# Altium schematic sheet 12_GPIO_I2S0_PDM_SPDIF.SchDoc: P30L
size A2; Organization: 六零加智能科技; Address4: www.nidone.com.cn; DocumentNumber: Kang jin; Revision: 1.0; SheetNumber: 12; SheetTotal: 23
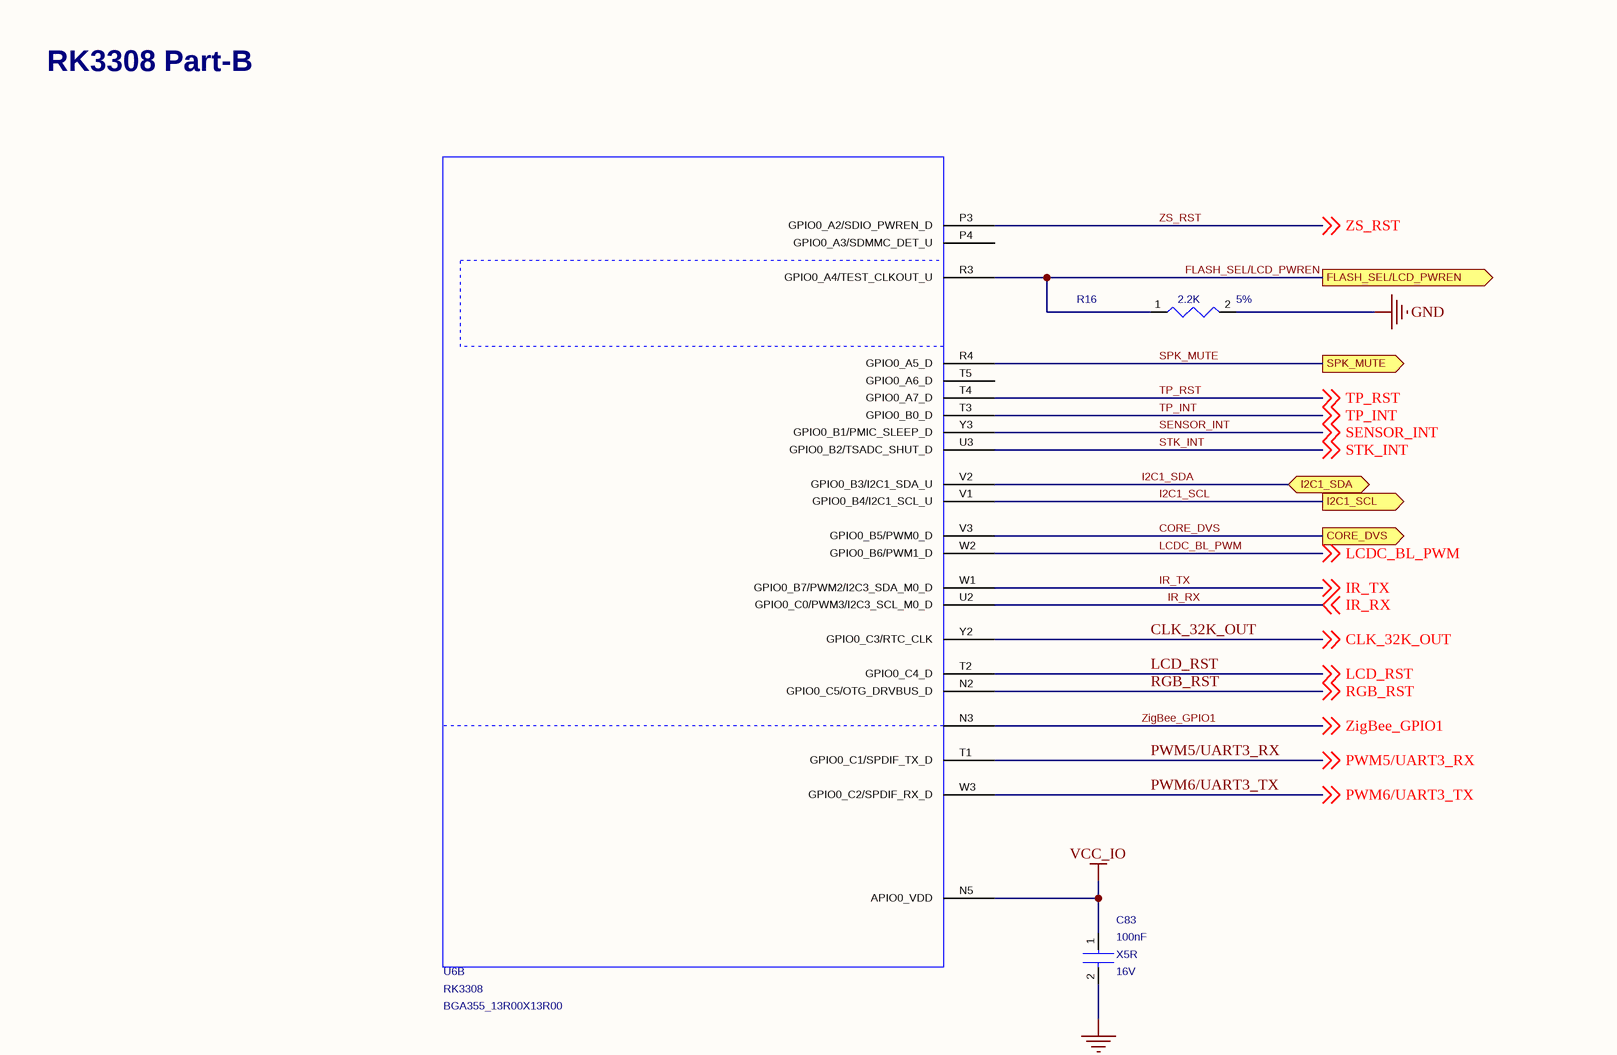
[diagram p0: 12_GPIO_I2S0_PDM_SPDIF.SchDoc, top left]
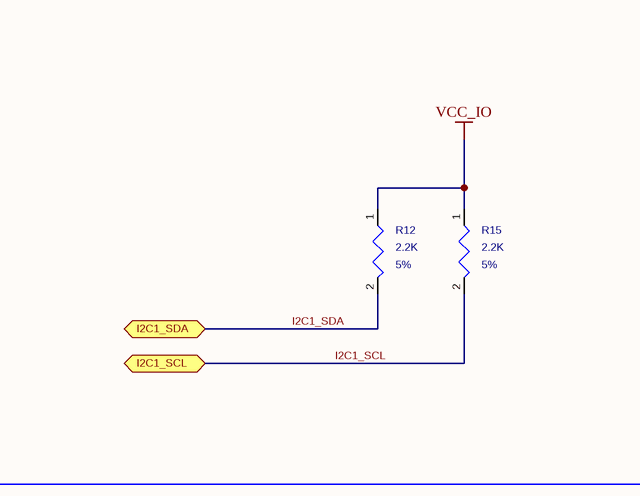
[diagram p1: 12_GPIO_I2S0_PDM_SPDIF.SchDoc, top right]
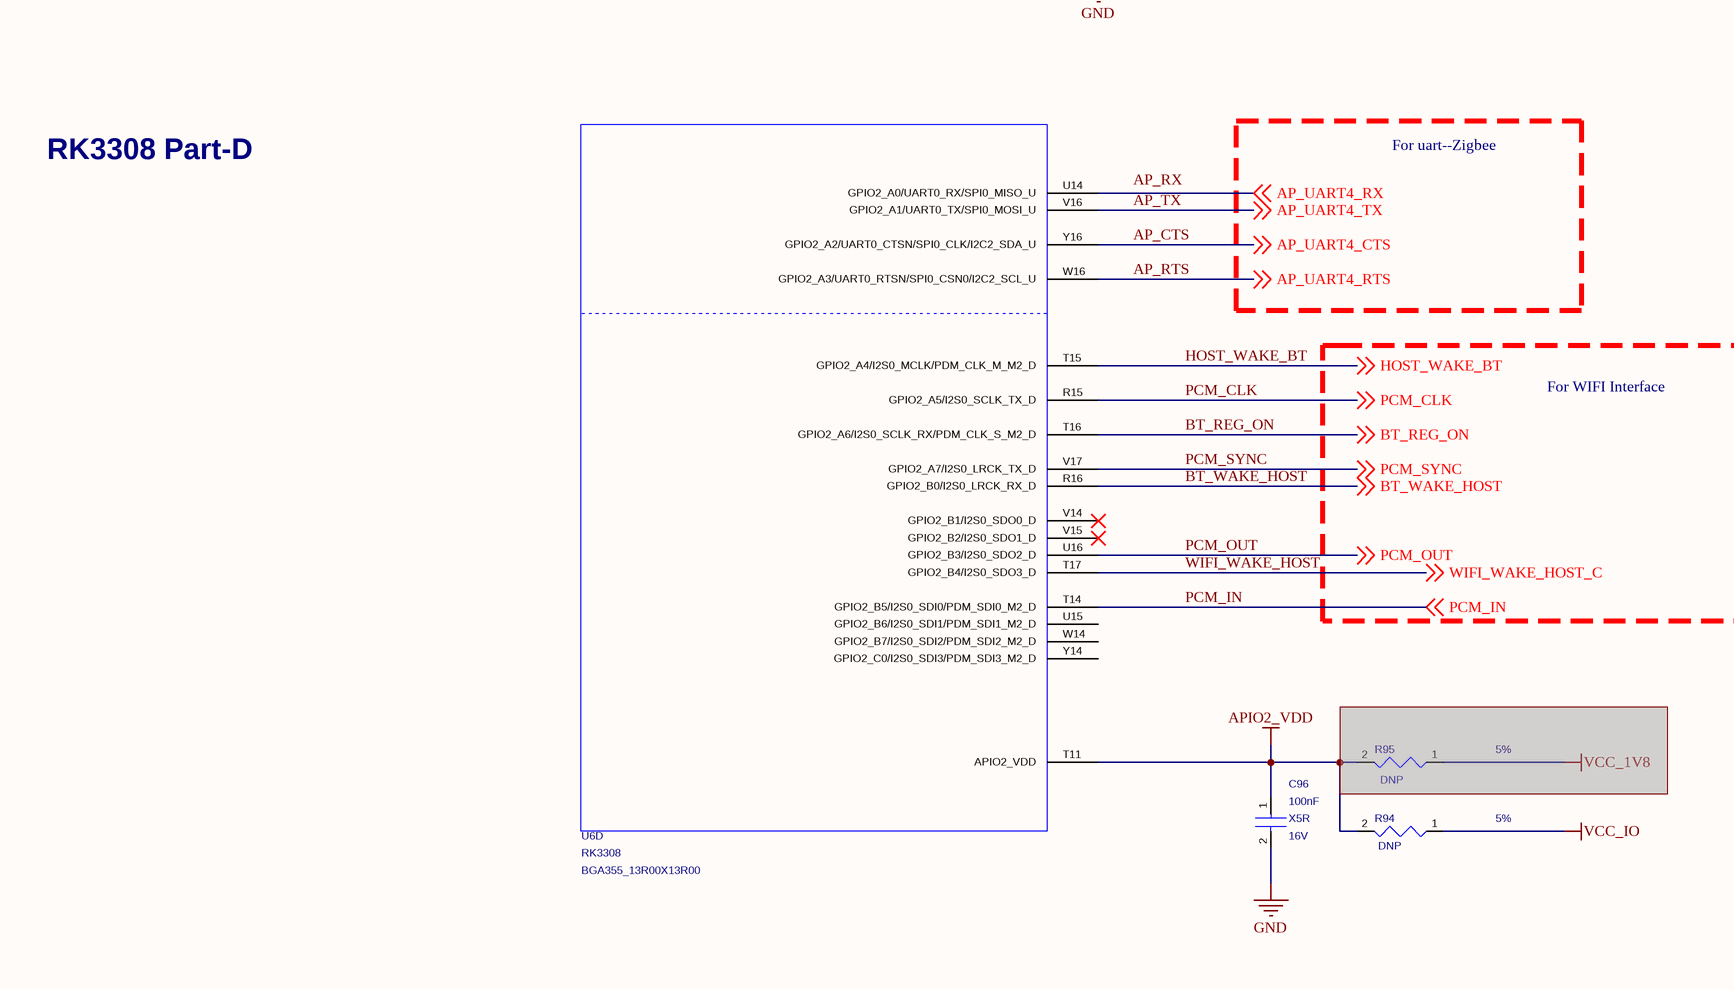
[diagram p2: 12_GPIO_I2S0_PDM_SPDIF.SchDoc, bottom left]

## Parts
C83  value 100nF  Voltage: 16V  Dielectric: X5R  [C0402]  (hidden comment: CAP_NP_2)
C96  value 100nF  Dielectric: X5R  Voltage: 16V  [C0402]  (hidden comment: CAP_NP_2)
R12  value 2.2K  Tolerance: 5%  [R0402]  (hidden comment: RESISTOR)
R15  value 2.2K  Tolerance: 5%  [R0402]  (hidden comment: RESISTOR)
R16  value 2.2K  Tolerance: 5%  [R0402]  (hidden comment: RESISTOR)
R94  Tolerance: 5%  Option: DNP  [R0402]  (hidden comment: RESISTOR)
R95  Tolerance: 5%  Option: DNP  [R0402]  (hidden comment: RESISTOR)  (masked out: inside a compile mask, not in the netlist)
U6  RK3308  [BGA355_13R00X13R00]  (parts B,D of 14)

## Ports
CORE_DVS (out), FLASH_SEL/LCD_PWREN (out), I2C1_SCL (bidir), I2C1_SCL (out), I2C1_SDA (bidir), SPK_MUTE (out)

## Nets
APIO2_VDD: C96.1 R94.2 U6.T11(APIO2_VDD)
GND: C83.2 C96.2 R16.2
VCC_IO: C83.1 R12.1 R15.1 R94.1 U6.N5(APIO0_VDD)
AP_CTS: U6.Y16(GPIO2_A2/UART0_CTSN/SPI0_CLK/I2C2_SDA_U) ; off-sheet AP_UART4_CTS  [also labelled AP_UART4_CTS]
AP_RTS: U6.W16(GPIO2_A3/UART0_RTSN/SPI0_CSN0/I2C2_SCL_U) ; off-sheet AP_UART4_RTS  [also labelled AP_UART4_RTS]
AP_TX: U6.V16(GPIO2_A1/UART0_TX/SPI0_MOSI_U) ; off-sheet AP_UART4_TX  [also labelled AP_UART4_TX]
AP_UART4_RX: U6.U14(GPIO2_A0/UART0_RX/SPI0_MISO_U) ; off-sheet AP_UART4_RX
BT_REG_ON: U6.T16(GPIO2_A6/I2S0_SCLK_RX/PDM_CLK_S_M2_D) ; off-sheet BT_REG_ON
BT_WAKE_HOST: U6.R16(GPIO2_B0/I2S0_LRCK_RX_D) ; off-sheet BT_WAKE_HOST
CLK_32K_OUT: U6.Y2(GPIO0_C3/RTC_CLK) ; off-sheet CLK_32K_OUT
CORE_DVS: U6.V3(GPIO0_B5/PWM0_D) ; port CORE_DVS
FLASH_SEL/LCD_PWREN: R16.1 U6.R3(GPIO0_A4/TEST_CLKOUT_U) ; port FLASH_SEL/LCD_PWREN
HOST_WAKE_BT: U6.T15(GPIO2_A4/I2S0_MCLK/PDM_CLK_M_M2_D) ; off-sheet HOST_WAKE_BT
I2C1_SCL: R15.2 U6.V1(GPIO0_B4/I2C1_SCL_U) ; port I2C1_SCL
I2C1_SDA: R12.2 U6.V2(GPIO0_B3/I2C1_SDA_U) ; port I2C1_SDA
IR_RX: U6.U2(GPIO0_C0/PWM3/I2C3_SCL_M0_D) ; off-sheet IR_RX
IR_TX: U6.W1(GPIO0_B7/PWM2/I2C3_SDA_M0_D) ; off-sheet IR_TX
LCD_RST: U6.T2(GPIO0_C4_D) ; off-sheet LCD_RST
LCDC_BL_PWM: U6.W2(GPIO0_B6/PWM1_D) ; off-sheet LCDC_BL_PWM
PCM_CLK: U6.R15(GPIO2_A5/I2S0_SCLK_TX_D) ; off-sheet PCM_CLK
PCM_IN: U6.T14(GPIO2_B5/I2S0_SDI0/PDM_SDI0_M2_D) ; off-sheet PCM_IN
PCM_OUT: U6.U16(GPIO2_B3/I2S0_SDO2_D) ; off-sheet PCM_OUT
PCM_SYNC: U6.V17(GPIO2_A7/I2S0_LRCK_TX_D) ; off-sheet PCM_SYNC
PWM5/UART3_RX: U6.T1(GPIO0_C1/SPDIF_TX_D) ; off-sheet PWM5/UART3_RX
PWM6/UART3_TX: U6.W3(GPIO0_C2/SPDIF_RX_D) ; off-sheet PWM6/UART3_TX
RGB_RST: U6.N2(GPIO0_C5/OTG_DRVBUS_D) ; off-sheet RGB_RST
SENSOR_INT: U6.Y3(GPIO0_B1/PMIC_SLEEP_D) ; off-sheet SENSOR_INT
SPK_MUTE: U6.R4(GPIO0_A5_D) ; port SPK_MUTE
STK_INT: U6.U3(GPIO0_B2/TSADC_SHUT_D) ; off-sheet STK_INT
TP_INT: U6.T3(GPIO0_B0_D) ; off-sheet TP_INT
TP_RST: U6.T4(GPIO0_A7_D) ; off-sheet TP_RST
WIFI_WAKE_HOST: U6.T17(GPIO2_B4/I2S0_SDO3_D) ; off-sheet WIFI_WAKE_HOST_C  [also labelled WIFI_WAKE_HOST_C]
ZigBee_GPIO1: U6.N3 ; off-sheet ZigBee_GPIO1
ZS_RST: U6.P3(GPIO0_A2/SDIO_PWREN_D) ; off-sheet ZS_RST

Not connected (* = marked no-connect by the designer): U6 P4(GPIO0_A3/SDMMC_DET_U) T5(GPIO0_A6_D) U15(GPIO2_B6/I2S0_SDI1/PDM_SDI1_M2_D) V14(GPIO2_B1/I2S0_SDO0_D)* V15(GPIO2_B2/I2S0_SDO1_D)* W14(GPIO2_B7/I2S0_SDI2/PDM_SDI2_M2_D) Y14(GPIO2_C0/I2S0_SDI3/PDM_SDI3_M2_D)

## Notes on the sheet
- RK3308 Part-B
- RK3308 Part-D
- For uart--Zigbee
- For WIFI Interface
- Labels drawn without touching a wire or pin: AP_RX
- Title
- Size:
- Date:
- File:
- A2
- Engineer:
- Time:
- Revision:
- Sheet
- of

## Library data of the parts
C83 = CAP_NP_2: cap,100.00nF,+/-10%,16V,X5R,C0402; Manufacturer_PN: C1005X5R1C104K050BA; Manufacturer: TDK; Created_by: JJJ; Tolerance: 10%; Priority: A; Source_Path: Z:\RK_STANDARD_LIBRARY\CADENCE_CIS\RK_DISCRETE.OLB; Number: 1; Part_Type: C0402; RK_PN: C1005X5R1C104K050BA; PCB DECAL: C0402
C96 = CAP_NP_2: cap,100.00nF,+/-10%,16V,X5R,C0402; Manufacturer: TDK; RK_PN: C1005X5R1C104K050BA; Priority: A; Tolerance: 10%; Created_by: JJJ; Source_Path: Z:\RK_STANDARD_LIBRARY\CADENCE_CIS\RK_DISCRETE.OLB; Number: 1; Part_Type: C0402; Manufacturer_PN: C1005X5R1C104K050BA; PCB DECAL: C0402
R12 = RESISTOR: ?用厚膜电阻,2K2,+/-5%,R0402,1/16W.; Manufacturer_PN: RC0402JR-072K2L; Manufacturer: YAGEO; Created_by: YTL; Wattage: 1/16W; Priority: A; Source_Path: Z:\RK_STANDARD_LIBRARY\CADENCE_CIS\RK_DISCRETE.OLB; Part_Type: ?用厚膜电阻; RK_PN: RC0402JR-072K2L; PCB DECAL: R0402
R15 = RESISTOR: ?用厚膜电阻,2K2,+/-5%,R0402,1/16W.; Manufacturer: YAGEO; RK_PN: RC0402JR-072K2L; Priority: A; Wattage: 1/16W; Created_by: YTL; Source_Path: Z:\RK_STANDARD_LIBRARY\CADENCE_CIS\RK_DISCRETE.OLB; Part_Type: ?用厚膜电阻; Manufacturer_PN: RC0402JR-072K2L; PCB DECAL: R0402
R16 = RESISTOR: ?用厚膜电阻,2.2K,+/-5%,R0402,1/16W.; Manufacturer: YAGEO; RK_PN: RC0402JR-070RL; Priority: A; Wattage: 1/16W; Created_by: YTL; Source_Path: Z:\RK_STANDARD_LIBRARY\CADENCE_CIS\RK_DISCRETE.OLB; Number: 1; Part_Type: ?用厚膜电阻; Manufacturer_PN: RC0402JR-070RL; PCB DECAL: R0402
R94 R95 = RESISTOR: ?用厚膜电阻,0R,+/-5%,R0402,1/16W.; Manufacturer: YAGEO; RK_PN: RC0402JR-070RL; Priority: A; Wattage: 1/16W; Created_by: YTL; Source_Path: Z:\RK_STANDARD_LIBRARY\CADENCE_CIS\RK_DISCRETE.OLB; Number: 1; Part_Type: ?用厚膜电阻; Manufacturer_PN: RC0402JR-070RL; PCB DECAL: R0402; Value: 0R
U6 = RK3308: Manufacturer: ROCKCHIP; Source_Path: E:\SCHEMETIC\RKSCH.OLB; Number: 1; Manufacturer_PN: RK3308; PCB DECAL: BGA355_13R00X13R00; Value: RK3308